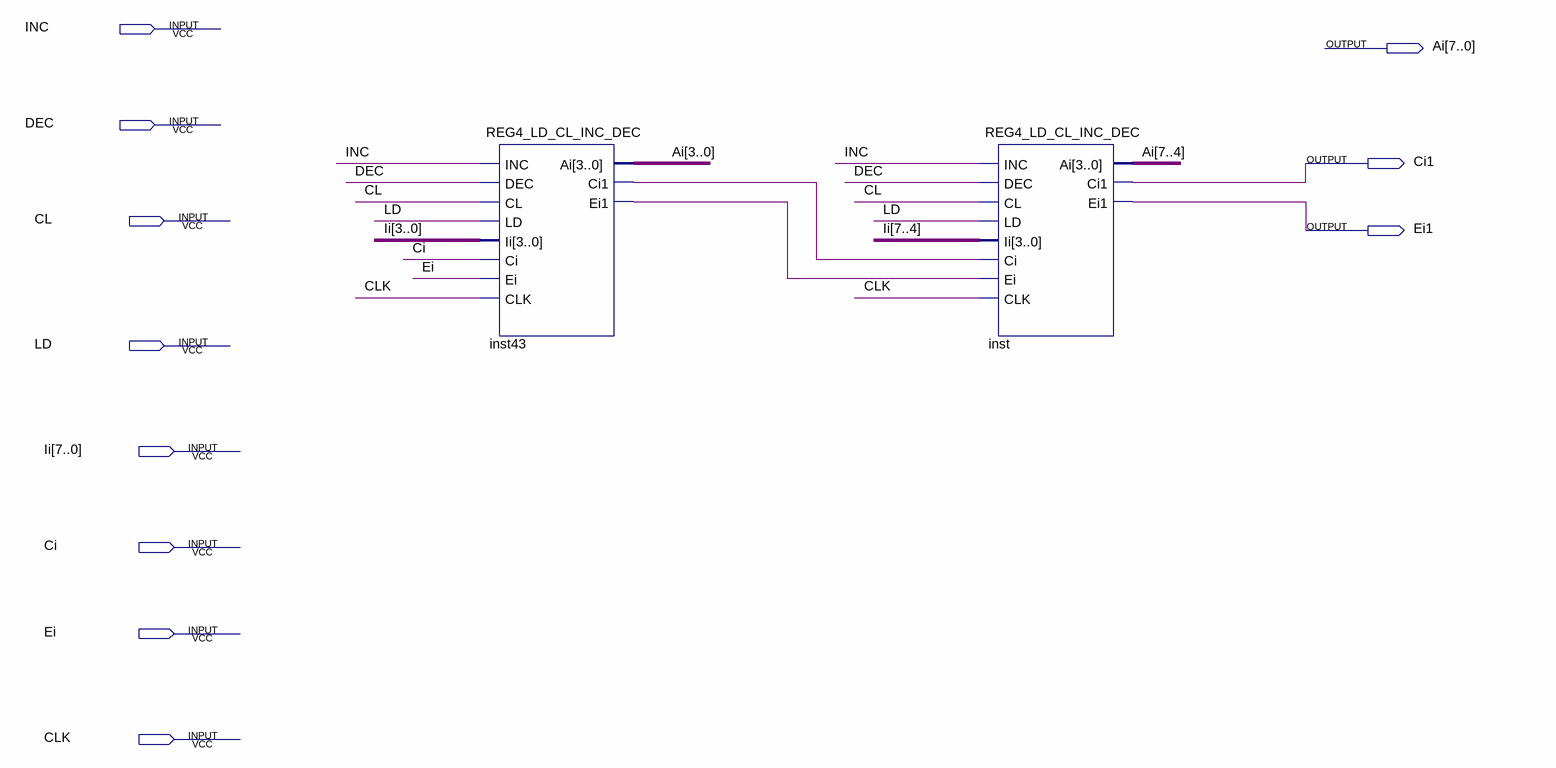
[diagram p0: schematic sheet]
// Quartus schematic REG8_LD_CL_INC_DEC.bdf as structural Verilog: 2 symbols, 11 pins
module REG8_LD_CL_INC_DEC (
  input  INC,
  input  DEC,
  input  CL,
  input  LD,
  input  [7:0] Ii,
  input  Ci,
  input  Ei,
  input  CLK,
  output [7:0] Ai,
  output Ci1,
  output Ei1
);

  wire inst43_ci1, inst43_ei1;

  REG4_LD_CL_INC_DEC inst43 (
    .INC(INC), .DEC(DEC), .CL(CL), .LD(LD), .Ii(Ii[3:0]), .Ci(Ci), .Ei(Ei), .CLK(CLK), .Ai(Ai[3:0]),
    .Ci1(inst43_ci1), .Ei1(inst43_ei1));
  REG4_LD_CL_INC_DEC inst (
    .INC(INC), .DEC(DEC), .CL(CL), .LD(LD), .Ii(Ii[7:4]), .Ci(inst43_ci1), .Ei(inst43_ei1), .CLK(CLK),
    .Ai(Ai[7:4]), .Ci1(Ci1), .Ei1(Ei1));
endmodule
